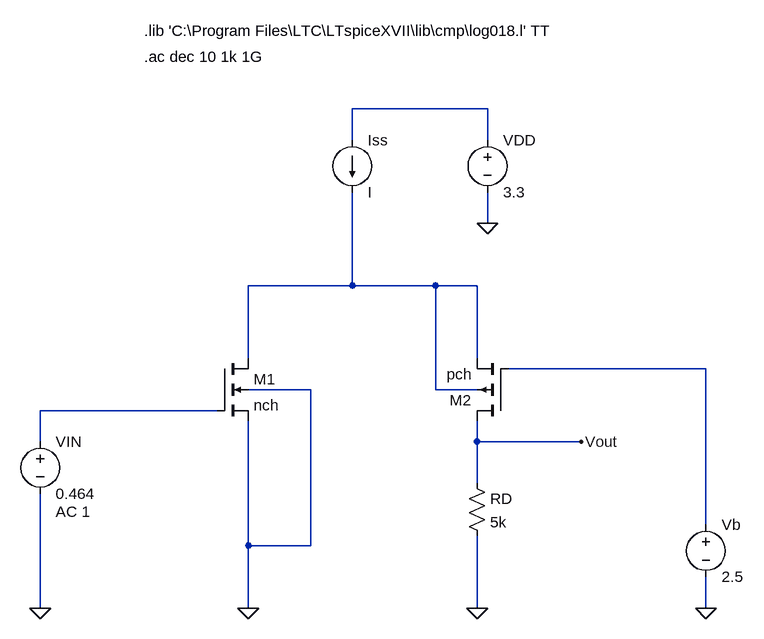
[diagram p0: schematic ng.asc]
ng.asc, the LTspice schematic file:
Version 4
SHEET 1 1116 1236
WIRE 384 96 176 96
WIRE 176 144 176 96
WIRE 384 144 384 96
WIRE 384 272 384 224
WIRE 176 368 176 224
WIRE 176 368 16 368
WIRE 304 368 176 368
WIRE 368 368 304 368
WIRE 16 480 16 368
WIRE 368 480 368 368
WIRE 720 496 416 496
WIRE 112 528 16 528
WIRE 304 528 304 368
WIRE 368 528 304 528
WIRE -32 560 -304 560
WIRE -304 608 -304 560
WIRE 368 608 368 576
WIRE 528 608 368 608
WIRE 368 672 368 608
WIRE 720 736 720 496
WIRE 16 768 16 576
WIRE 112 768 112 528
WIRE 112 768 16 768
WIRE -304 864 -304 688
WIRE 16 864 16 768
WIRE 368 864 368 752
WIRE 720 864 720 816
FLAG 384 272 0
FLAG 528 608 Vout
FLAG 368 864 0
FLAG 720 864 0
FLAG 16 864 0
FLAG -304 864 0
SYMBOL nmos4 -32 480 R0
SYMATTR InstName M1
SYMATTR Value nch
SYMATTR Value2 l=0.18u w=36u
SYMBOL pmos4 416 576 R180
SYMATTR InstName M2
SYMATTR Value pch
SYMATTR Value2 l=0.36u w=18u
SYMBOL voltage 384 128 R0
WINDOW 123 0 0 Left 0
WINDOW 39 0 0 Left 0
SYMATTR InstName VDD
SYMATTR Value 3.3
SYMBOL voltage -304 592 R0
WINDOW 123 24 124 Left 2
WINDOW 39 0 0 Left 0
SYMATTR Value2 AC 1
SYMATTR InstName VIN
SYMATTR Value 0.464
SYMBOL voltage 720 720 R0
WINDOW 123 0 0 Left 0
WINDOW 39 0 0 Left 0
SYMATTR InstName Vb
SYMATTR Value 2.5
SYMBOL current 176 144 R0
SYMATTR InstName Iss
SYMBOL res 352 656 R0
SYMATTR InstName RD
SYMATTR Value 5k
TEXT -144 -24 Left 2 !.lib 'C:\\Program Files\\LTC\\LTspiceXVII\\lib\\cmp\\log018.l' TT
TEXT -144 16 Left 2 !.ac dec 10 1k 1G

The netlist it stands for:
* ng.asc
M1 N002 N004 0 0 nch l=0.18u w=36u
M2 Vout N003 N002 N002 pch l=0.36u w=18u
VDD N001 0 3.3
VIN N004 0 0.464 AC 1
Vb N003 0 2.5
Iss N001 N002 I
RD Vout 0 5k
.model NMOS NMOS
.model PMOS PMOS
.lib standard.mos
.lib 'C:\Program Files\LTC\LTspiceXVII\lib\cmp\log018.l' TT
.ac dec 10 1k 1G
.backanno
.end